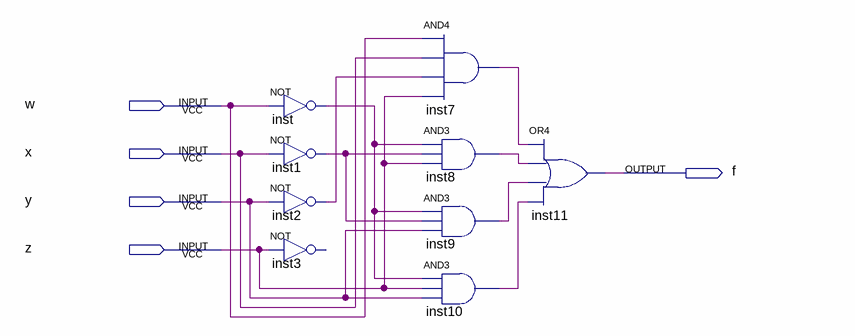
[diagram p0: schematic sheet]
// Quartus schematic F.bdf as structural Verilog: 9 symbols, 5 pins
module F (
  input  w,
  input  x,
  input  y,
  input  z,
  output f
);

  wire inst1_out, inst2_out, inst7_out, inst8_out, inst9_out, inst10_out, inst_out;

  not inst (inst_out, w);
  not inst1 (inst1_out, x);
  not inst2 (inst2_out, y);
  // NOT inst3 has open pins: IN=z, OUT=open
  and inst7 (inst7_out, w, x, inst2_out, z);
  and inst8 (inst8_out, inst_out, inst1_out, z);
  and inst9 (inst9_out, inst_out, inst1_out, y);
  and inst10 (inst10_out, inst_out, z, y);
  or inst11 (f, inst7_out, inst8_out, inst9_out, inst10_out);
endmodule
